# Altium schematic sheet FPGA_MGT.SchDoc
size A3
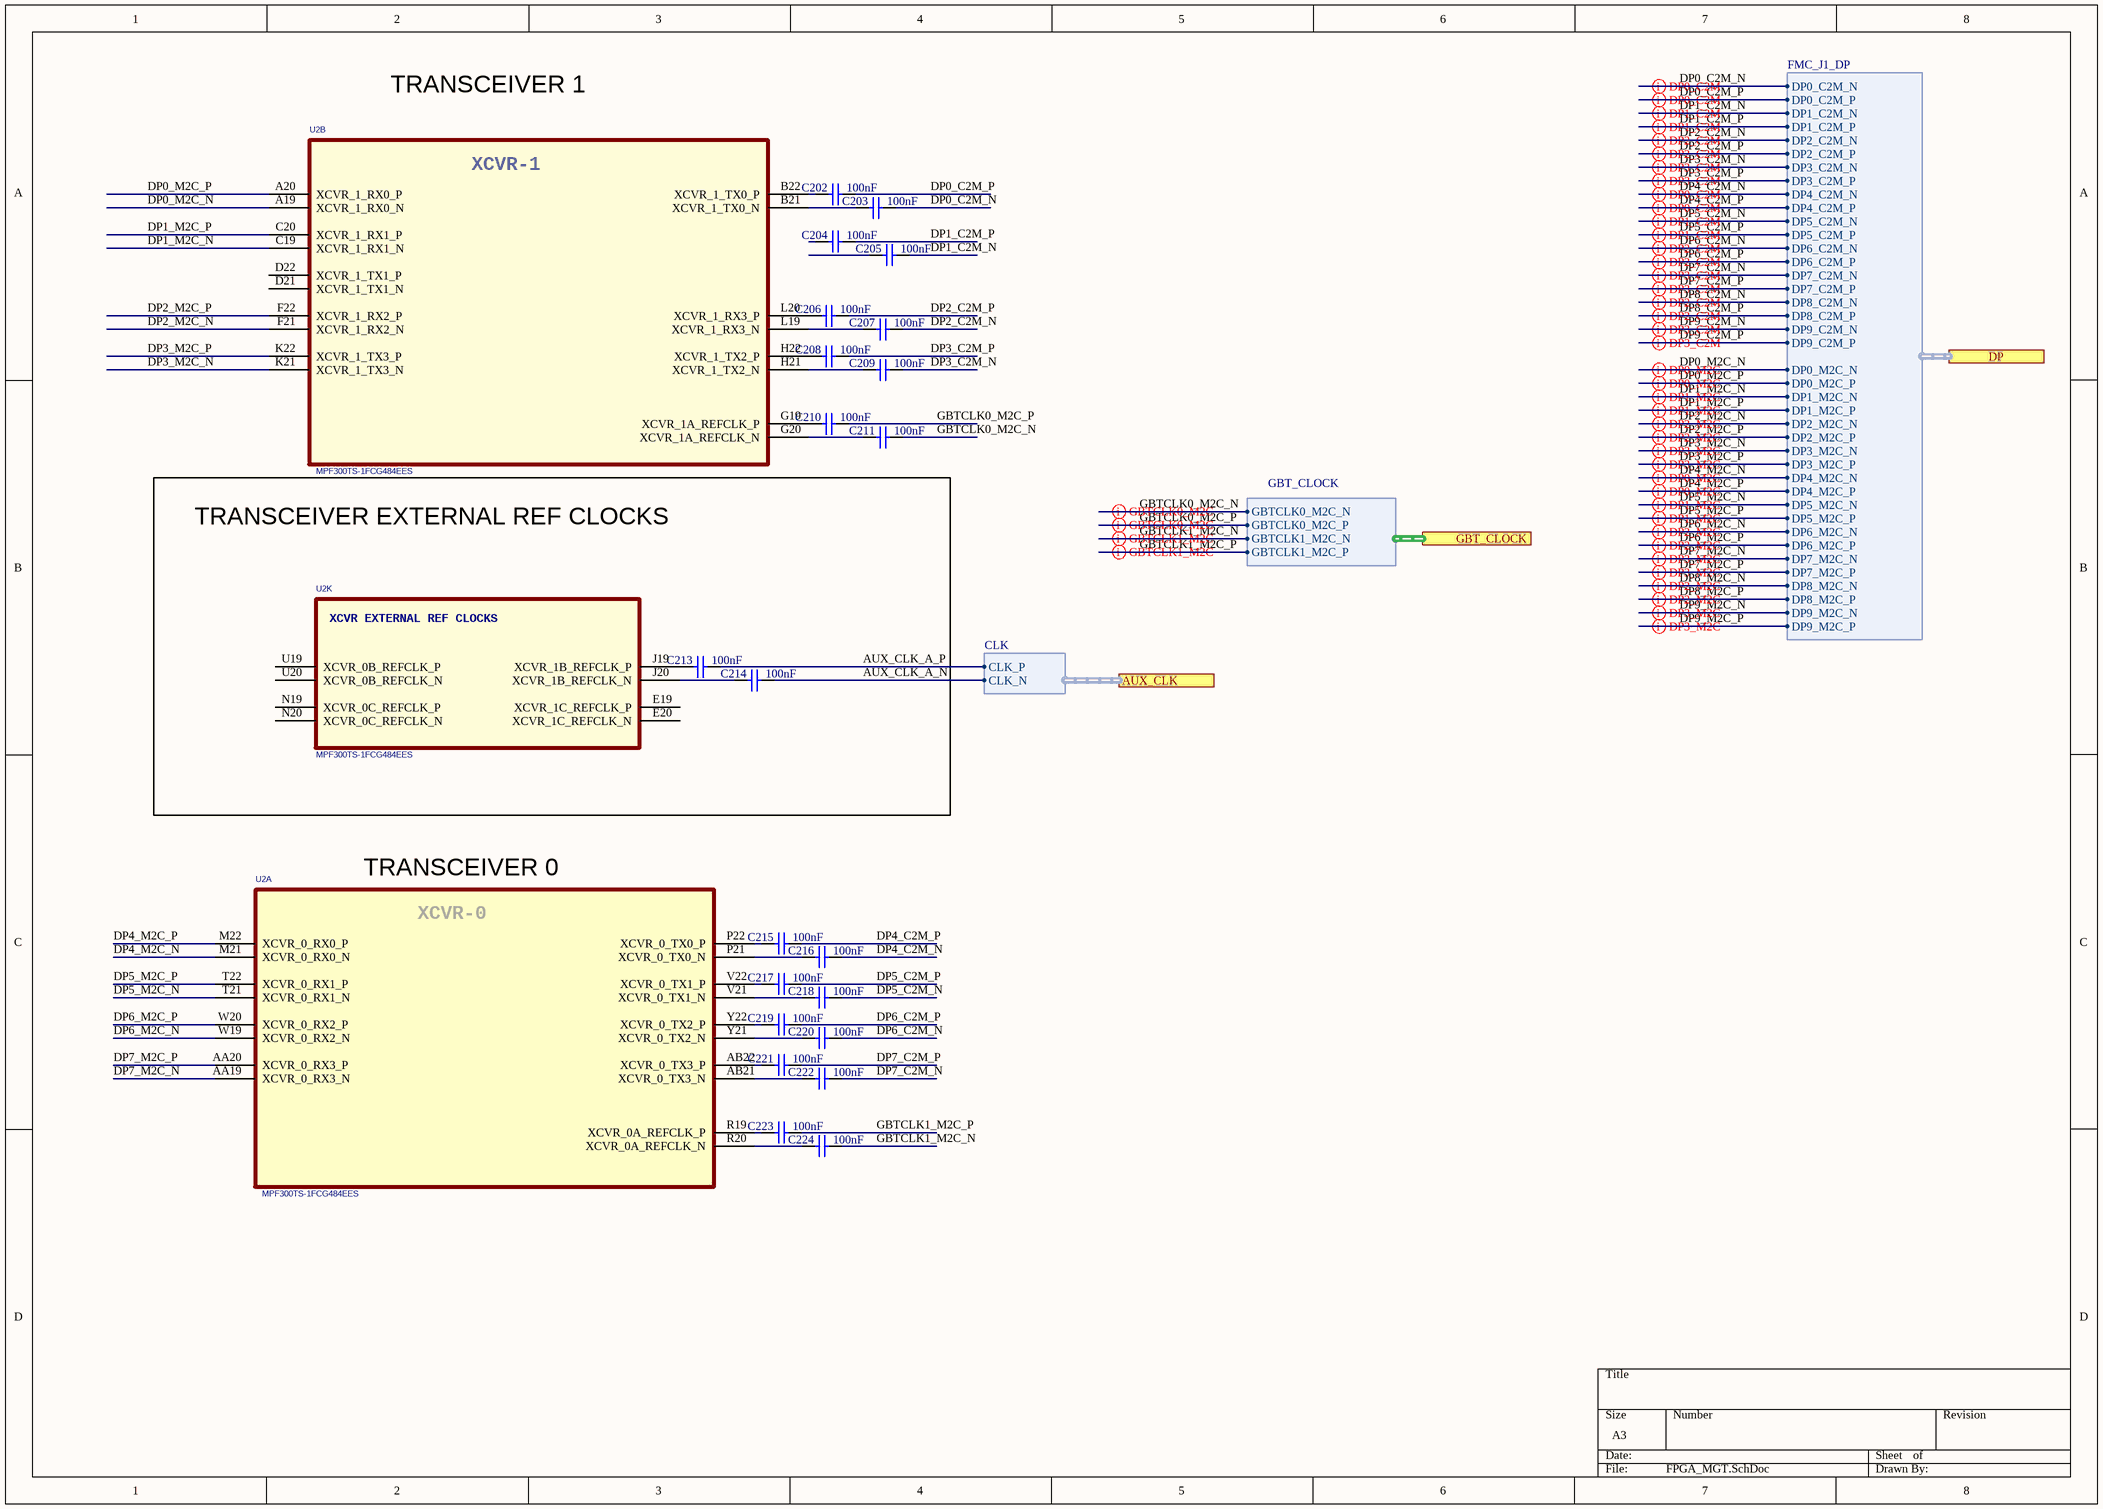
[diagram p0: FPGA_MGT.SchDoc]

## Parts
C202  100nF  [CAPC0603X33N]
C203  100nF  [CAPC0603X33N]
C204  100nF  [CAPC0603X33N]
C205  100nF  [CAPC0603X33N]
C206  100nF  [CAPC0603X33N]
C207  100nF  [CAPC0603X33N]
C208  100nF  [CAPC0603X33N]
C209  100nF  [CAPC0603X33N]
C210  100nF  [CAPC0603X33N]
C211  100nF  [CAPC0603X33N]
C213  100nF  [CAPC0603X33N]
C214  100nF  [CAPC0603X33N]
C215  100nF  [CAPC0603X33N]
C216  100nF  [CAPC0603X33N]
C217  100nF  [CAPC0603X33N]
C218  100nF  [CAPC0603X33N]
C219  100nF  [CAPC0603X33N]
C220  100nF  [CAPC0603X33N]
C221  100nF  [CAPC0603X33N]
C222  100nF  [CAPC0603X33N]
C223  100nF  [CAPC0603X33N]
C224  100nF  [CAPC0603X33N]
U2  MPF300TS-1FCG484EES  [BGA484C100P22X22_2300X2300X320]  (parts A,B,K of 11)

## Blocks framed on the sheet
TRANSCEIVER EXTERNAL REF CLOCKS: C213 C214 U2

## Ports
AUX_CLK (harness CLK), DP (harness FMC_J1_DP), GBT_CLOCK (harness GBT_CLOCK)

## Harnesses
FMC_J1_DP: DP1_C2M_N, DP1_C2M_P, DP1_M2C_N, DP1_M2C_P, DP2_C2M_N, DP2_C2M_P, DP2_M2C_N, DP2_M2C_P, DP3_C2M_N, DP3_C2M_P, DP3_M2C_N, DP3_M2C_P, DP0_C2M_N, DP0_C2M_P, DP0_M2C_N, DP0_M2C_P, DP4_C2M_N, DP4_C2M_P, DP5_C2M_N, DP5_C2M_P, DP6_C2M_N, DP6_C2M_P, DP7_C2M_N, DP7_C2M_P, DP8_C2M_N, DP8_C2M_P, DP9_C2M_N, DP9_C2M_P, DP4_M2C_N, DP4_M2C_P, DP5_M2C_N, DP5_M2C_P, DP6_M2C_N, DP6_M2C_P, DP7_M2C_N, DP7_M2C_P, DP8_M2C_N, DP8_M2C_P, DP9_M2C_N, DP9_M2C_P
GBT_CLOCK: GBTCLK0_M2C_N, GBTCLK0_M2C_P, GBTCLK1_M2C_N, GBTCLK1_M2C_P
CLK: CLK_P, CLK_N

## Nets
AUX_CLK_A_N: C214.2 ; port AUX_CLK.CLK_N
AUX_CLK_A_P: C213.2 ; port AUX_CLK.CLK_P
DP0_C2M_N: C203.2 ; port DP.DP0_C2M_N
DP0_C2M_P: C202.2 ; port DP.DP0_C2M_P
DP0_M2C_N: U2.A19(XCVR_1_RX0_N) ; port DP.DP0_M2C_N
DP0_M2C_P: U2.A20(XCVR_1_RX0_P) ; port DP.DP0_M2C_P
DP1_C2M_N: C205.2 ; port DP.DP1_C2M_N
DP1_C2M_P: C204.2 ; port DP.DP1_C2M_P
DP1_M2C_N: U2.C19(XCVR_1_RX1_N) ; port DP.DP1_M2C_N
DP1_M2C_P: U2.C20(XCVR_1_RX1_P) ; port DP.DP1_M2C_P
DP2_C2M_N: C207.2 ; port DP.DP2_C2M_N
DP2_C2M_P: C206.2 ; port DP.DP2_C2M_P
DP2_M2C_N: U2.F21(XCVR_1_RX2_N) ; port DP.DP2_M2C_N
DP2_M2C_P: U2.F22(XCVR_1_RX2_P) ; port DP.DP2_M2C_P
DP3_C2M_N: C209.2 ; port DP.DP3_C2M_N
DP3_C2M_P: C208.2 ; port DP.DP3_C2M_P
DP3_M2C_N: U2.K21(XCVR_1_TX3_N) ; port DP.DP3_M2C_N
DP3_M2C_P: U2.K22(XCVR_1_TX3_P) ; port DP.DP3_M2C_P
DP4_C2M_N: C216.2 ; port DP.DP4_C2M_N
DP4_C2M_P: C215.2 ; port DP.DP4_C2M_P
DP4_M2C_N: U2.M21(XCVR_0_RX0_N) ; port DP.DP4_M2C_N
DP4_M2C_P: U2.M22(XCVR_0_RX0_P) ; port DP.DP4_M2C_P
DP5_C2M_N: C218.2 ; port DP.DP5_C2M_N
DP5_C2M_P: C217.2 ; port DP.DP5_C2M_P
DP5_M2C_N: U2.T21(XCVR_0_RX1_N) ; port DP.DP5_M2C_N
DP5_M2C_P: U2.T22(XCVR_0_RX1_P) ; port DP.DP5_M2C_P
DP6_C2M_N: C220.2 ; port DP.DP6_C2M_N
DP6_C2M_P: C219.2 ; port DP.DP6_C2M_P
DP6_M2C_N: U2.W19(XCVR_0_RX2_N) ; port DP.DP6_M2C_N
DP6_M2C_P: U2.W20(XCVR_0_RX2_P) ; port DP.DP6_M2C_P
DP7_C2M_N: C222.2 ; port DP.DP7_C2M_N
DP7_C2M_P: C221.2 ; port DP.DP7_C2M_P
DP7_M2C_N: U2.AA19(XCVR_0_RX3_N) ; port DP.DP7_M2C_N
DP7_M2C_P: U2.AA20(XCVR_0_RX3_P) ; port DP.DP7_M2C_P
DP8_C2M_N: port DP.DP8_C2M_N
DP8_C2M_P: port DP.DP8_C2M_P
DP8_M2C_N: port DP.DP8_M2C_N
DP8_M2C_P: port DP.DP8_M2C_P
DP9_C2M_N: port DP.DP9_C2M_N
DP9_C2M_P: port DP.DP9_C2M_P
DP9_M2C_N: port DP.DP9_M2C_N
DP9_M2C_P: port DP.DP9_M2C_P
GBTCLK0_M2C_N: C211.2 ; port GBT_CLOCK.GBTCLK0_M2C_N
GBTCLK0_M2C_P: C210.2 ; port GBT_CLOCK.GBTCLK0_M2C_P
GBTCLK1_M2C_N: C224.2 ; port GBT_CLOCK.GBTCLK1_M2C_N
GBTCLK1_M2C_P: C223.2 ; port GBT_CLOCK.GBTCLK1_M2C_P
NetC202_1: C202.1 U2.B22(XCVR_1_TX0_P)
NetC203_1: C203.1 U2.B21(XCVR_1_TX0_N)
NetC206_1: C206.1 U2.L20(XCVR_1_RX3_P)
NetC207_1: C207.1 U2.L19(XCVR_1_RX3_N)
NetC208_1: C208.1 U2.H22(XCVR_1_TX2_P)
NetC209_1: C209.1 U2.H21(XCVR_1_TX2_N)
NetC210_1: C210.1 U2.G19(XCVR_1A_REFCLK_P)
NetC211_1: C211.1 U2.G20(XCVR_1A_REFCLK_N)
NetC213_1: C213.1 U2.J19(XCVR_1B_REFCLK_P)
NetC214_1: C214.1 U2.J20(XCVR_1B_REFCLK_N)
NetC215_1: C215.1 U2.P22(XCVR_0_TX0_P)
NetC216_1: C216.1 U2.P21(XCVR_0_TX0_N)
NetC217_1: C217.1 U2.V22(XCVR_0_TX1_P)
NetC218_1: C218.1 U2.V21(XCVR_0_TX1_N)
NetC219_1: C219.1 U2.Y22(XCVR_0_TX2_P)
NetC220_1: C220.1 U2.Y21(XCVR_0_TX2_N)
NetC221_1: C221.1 U2.AB22(XCVR_0_TX3_P)
NetC222_1: C222.1 U2.AB21(XCVR_0_TX3_N)
NetC223_1: C223.1 U2.R19(XCVR_0A_REFCLK_P)
NetC224_1: C224.1 U2.R20(XCVR_0A_REFCLK_N)

Not connected (* = marked no-connect by the designer): C204 1; C205 1; U2 D21(XCVR_1_TX1_N) D22(XCVR_1_TX1_P) E19(XCVR_1C_REFCLK_P) E20(XCVR_1C_REFCLK_N) N19(XCVR_0C_REFCLK_P) N20(XCVR_0C_REFCLK_N) U19(XCVR_0B_REFCLK_P) U20(XCVR_0B_REFCLK_N)

## Layout directives
differential pair: DP0_C2M_N, DP0_C2M_P, DP0_M2C_N, DP0_M2C_P, DP1_C2M_N, DP1_C2M_P, DP1_M2C_N, DP1_M2C_P, DP2_C2M_N, DP2_C2M_P, DP2_M2C_N, DP2_M2C_P, DP3_C2M_N, DP3_C2M_P, DP3_M2C_N, DP3_M2C_P, DP4_C2M_N, DP4_C2M_P, DP4_M2C_N, DP4_M2C_P, DP5_C2M_N, DP5_C2M_P, DP5_M2C_N, DP5_M2C_P, DP6_C2M_N, DP6_C2M_P, DP6_M2C_N, DP6_M2C_P, DP7_C2M_N, DP7_C2M_P, DP7_M2C_N, DP7_M2C_P, DP8_C2M_N, DP8_C2M_P, DP8_M2C_N, DP8_M2C_P, DP9_C2M_N, DP9_C2M_P, DP9_M2C_N, DP9_M2C_P, GBTCLK0_M2C_N, GBTCLK0_M2C_P, GBTCLK1_M2C_N, GBTCLK1_M2C_P

## Notes on the sheet
- TRANSCEIVER 1
- TRANSCEIVER 0
- (in symbol FPGA_MPF300T-FCG484, part A) XCVR-0
- (in symbol FPGA_MPF300T-FCG484, part B) XCVR-1
- (in symbol FPGA_MPF300T-FCG484, part K) XCVR EXTERNAL REF CLOCKS

## Library data of the parts
C202-C211 C213-C224 = CC0201_100NF_6.3V_10%_X5R: Non-polarised capacitor; Part Description: SMD Multilayer Chip Ceramic Capacitor; Manufacturer: GENERIC; Manufacturer1 Part Number: 02016D104KAT2A; Voltage: 6.3V; TC: X5R; Tolerance: ±10%; Part Number: CC0201_100NF_6.3V_10%_X5R; Component Kind: Standard; Component Type: Standard; Pin Count: 2; Value: 100nF; Status: Not Recommended; Manufacturer Part Number: CC0201_100NF_6.3V_10%_X5R; Case: 0201; Mounted: Yes; Socket: No; SMD: Yes; Sense: No; Manufacturer1 Example: AVX; Manufacturer1 ComponentHeight: 0.33mm; HelpURL: \\cern.ch\dfs\Applications\Altium\Datasheets\CC0201_X5R_AVX.pdf; Author: CERN DEM JLC; CreateDate: 03.12.2007; LatestRevisionDate: 03.12.2007
U2 = FPGA_MPF300T-FCG484: FCG484,23mmX23mm,1.0mm pitch; Manufacturer: Microsemi; Part Number: MPF300TS-1FCG484I